# EAGLE design Plataforma_soldadora (EAGLE 6.5.0)
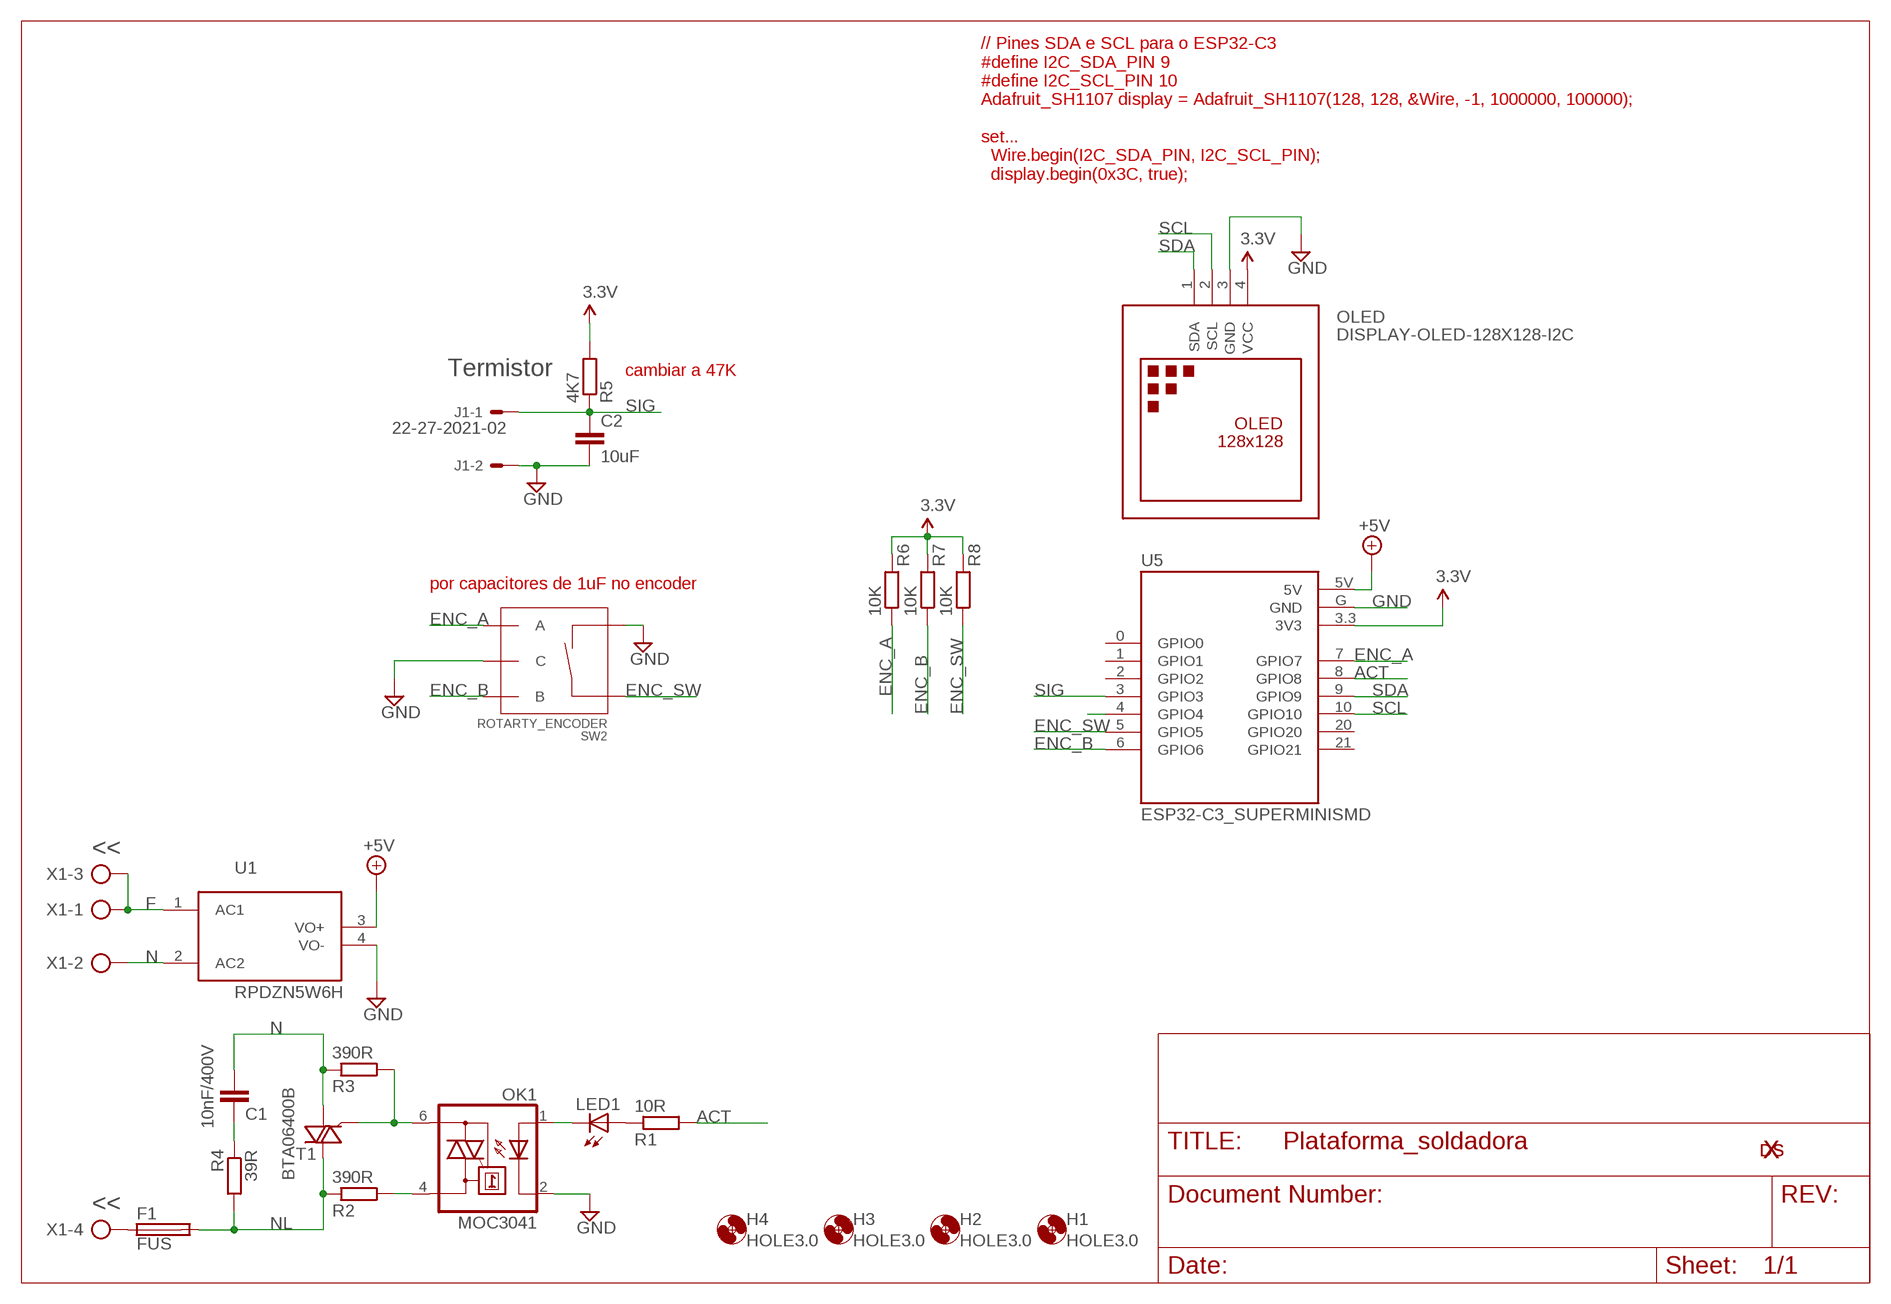
[diagram p0: schematic, sheet 1]

## Parts
C1  10nF/400V  C-EU075-042X103  [C075-042X103]
C2  10uF  C-EUC1206K  [C1206K]
F1  FUS  FUSETE5  [TE5]
H1  HOLE3.0  HOLES_MOUNT-HOLE3.0  [HOLES_3,0]
H2  HOLE3.0  HOLES_MOUNT-HOLE3.0  [HOLES_3,0]
H3  HOLE3.0  HOLES_MOUNT-HOLE3.0  [HOLES_3,0]
H4  HOLE3.0  HOLES_MOUNT-HOLE3.0  [HOLES_3,0]
J1  22-27-2021-02  [6410-02]
LED1  LED3MM  [LED3MM]
OK1  MOC3041  IL410  [DIL06]
OLED  DISPLAY-OLED-128X128-I2C  [DISPLAY-OLED-128X128-I2C]
R1  10R  R-EU_R0603  [R0603]
R2  390R  R-EU_0204/7  [0204/7]
R3  390R  R-EU_0204/7  [0204/7]
R4  39R  R-EU_0204/7  [0204/7]
R5  4K7  R-EU_R0603  [R0603]
R6  10K  R-EU_R0603  [R0603]
R7  10K  R-EU_R0603  [R0603]
R8  10K  R-EU_R0603  [R0603]
SW2  ROTARTY_ENCODER  [ROTARY_ENC_PLAIN]
T1  BTA06400B  BT136  [TO220AB]
U1  RPDZN5W6H  [RPDZN5W6H]
U5  ESP32-C3_SUPERMINISMD  [MODULE_ESP-C3_SUPERMINI_SMD]
U$2  XDESIG_XDESIG5MM  [XDESIG_XDESIG_CU]
U$3  XDESIG_XDESIG21  [XDESIG_XDESIG]
X1  AK500/4-H  [AK500/4-H]

## Nets
3.3V: OLED.4(VCC) R5.2 R6.2 R7.2 R8.2 U5.3.3(3V3)
+5V: U1.3(VO+) U5.5V
ACT: R1.2 U5.8(GPIO8)
ENC_A: R6.1 SW2.A U5.7(GPIO7)
ENC_B: R7.1 SW2.B U5.6(GPIO6)
ENC_SW: R8.1 SW2.SW+ U5.5(GPIO5)
F: U1.1(AC1) X1.1 X1.3
GND: C2.2 J1.2 OK1.2(C) OLED.3(GND) SW2.C SW2.SW- U1.4(VO-) U5.G(GND)
N: C1.2 R3.1 T1.1(A1) U1.2(AC2) X1.2
N$1: OK1.4(A1) R2.2
N$2: F1.1 X1.4
N$3: OK1.6(A2) R3.2 T1.3(G)
N$4: LED1.K(C) OK1.1(A)
N$5: LED1.A R1.1
N$11: C1.1 R4.1
N$120: U5.4(GPIO4)
NL: F1.2 R2.1 R4.2 T1.2(A2)
SCL: OLED.2(SCL) U5.10(GPIO10)
SDA: OLED.1(SDA) U5.9(GPIO9)
SIG: C2.1 J1.1 R5.1 U5.3(GPIO3)
Unconnected: U5.0(GPIO0) U5.1(GPIO1) U5.2(GPIO2) U5.20(GPIO20) U5.21(GPIO21)

## Notes on the sheet
- // Pines SDA e SCL para o ESP32-C3
  #define I2C_SDA_PIN 9
  #define I2C_SCL_PIN 10
  Adafruit_SH1107 display = Adafruit_SH1107(128, 128, &Wire, -1, 1000000, 100000);
  
  set...
    Wire.begin(I2C_SDA_PIN, I2C_SCL_PIN);
    display.begin(0x3C, true);
- Termistor | cambiar a 47K
- por capacitores de 1uF no encoder
- <<
- <<

## Library data of the parts
C1 C2 = rcl:C-EU: CAPACITOR, European symbol
F1 = fuse:FUSE: Fuse; OC_FARNELL: unknown; OC_NEWARK: unknown
H1-H4 = escorna_LBREscorna_CPU_2_10:HOLES_MOUNT-HOLE: MOUNTING HOLE with drill center marker
J1 = con-molex:22-?-02: CONNECTOR wire to board 2.54 mm (.1 inch) pitch header; OC_FARNELL: unknown; OC_NEWARK: unknown
LED1 = led:LED: LED OSRAM: - CHIPLED LG R971, LG N971, LY N971, LG Q971, LY Q971, LO R971, LY R971 LH N974, LH R974 LS Q976, LO Q976, LY Q976 LO Q996 - Hyper CHIPLED LW Q18S LB Q993, LB Q99A, LB R99A - SideLED LS A670, LO A670, LY A670, LG A670, LP A670 LB A673, LV A673, LT A673, LW A673 LH A674 LY A675 LS A676, LA A676, LO A676, LY A676, LW A676 LS A679, LY A679, LG A679 - Hyper Micro SIDELED® LS Y876, LA Y876, LO Y876, LY Y876 LT Y87S - SmartLED LW L88C, LW L88S LB L89C, LB L89S, LG L890 LS L89K, LO L89K, LY L89K LS L896, LA L896, LO L896, LY L896 - TOPLED LS T670, LO T670, LY T670, LG T670, LP T670 LSG T670, LSP T670, LSY T670, LOP T670, LYG T670 LG T671, LOG T671, LSG T671 LB T673, LV T673, LT T673, LW T673 LH T674 LS T676, LA T676, LO T676, LY T676, LB T676, LH T676, LSB T676, LW T676 LB T67C, LV T67C, LT T67C, LS T67K, LO T67K, LY T67K, LW E67C LS E67B, LA E67B, LO E67B, LY E67B, LB E67C, LV E67C, LT E67C LW T67C LS T679, LY T679, LG T679 LS T770, LO T770, LY T770, LG T770, LP T770 LB T773, LV T773, LT T773, LW T773 LH T774 LS E675, LA E675, LY E675, LS T675 LS T776, LA T776, LO T776, LY T776, LB T776 LHGB T686 LT T68C, LB T68C - Hyper Mini TOPLED® LB M676 - Mini TOPLED Santana® LG M470 LS M47K, LO M47K, LY M47K Source: http://www.osram.convergy.de LUXEON: - LUMILED® LXK2-PW12-R00, LXK2-PW12-S00, LXK2-PW14-U00, LXK2-PW14-V00 LXK2-PM12-R00, LXK2-PM12-S00, LXK2-PM14-U00 LXK2-PE12-Q00, LXK2-PE12-R00, LXK2-PE12-S00, LXK2-PE14-T00, LXK2-PE14-U00 LXK2-PB12-K00, LXK2-PB12-L00, LXK2-PB12-M00, LXK2-PB14-N00, LXK2-PB14-P00, LXK2-PB14-Q00 LXK2-PR12-L00, LXK2-PR12-M00, LXK2-PR14-Q00, LXK2-PR14-R00 LXK2-PD12-Q00, LXK2-PD12-R00, LXK2-PD12-S00 LXK2-PH12-R00, LXK2-PH12-S00 LXK2-PL12-P00, LXK2-PL12-Q00, LXK2-PL12-R00 Source: www.luxeon.com KINGBRIGHT: KA-3528ASYC Source: www.kingbright.com
OK1 = optocoupler:IL410: SIEMENS OPTO COUPLER; MF: VISHAY/TELEFUNKEN; MPN: IL410; OC_FARNELL: 1045434; OC_NEWARK: 58K1715
OLED = diy-modules:DISPLAY-OLED-128X128-I2C
R1-R8 = rcl:R-EU_: RESISTOR, European symbol
SW2 = SparkFun-Electromechanical:ROTARTY_ENCODER: Simple no LED rotary encoder Example: COM-09117
T1 = triac:BT136: Triac BT136 series E sensitive gate Source: http://www.nxp.com/acrobat_download/datasheets/BT136_SERIES_E_2.pdf
U1 = RPDZN:RPDZN5W6
U5 = ESP32-C3_SUPERMINI:ESP32-C3_SUPERMINI: Check availability <https://pricing.snapeda.com/parts/ESP32-C3%20SuperMini/Espressif%20Systems/view-part?ref=eda>
U$2 U$3 = Echidna_shield_LBR:XDESIG_XDESIG
X1 = con-ptr500:AK500/4-H: CONNECTOR Aug. 2004 / PTR Meßtechnik: Die Bezeichnung der Serie AK505 wurde geändert. Es handelt sich hierbei um AK500 in horizontaler Ausführung.; OC_FARNELL: unknown; OC_NEWARK: unknown

## Board
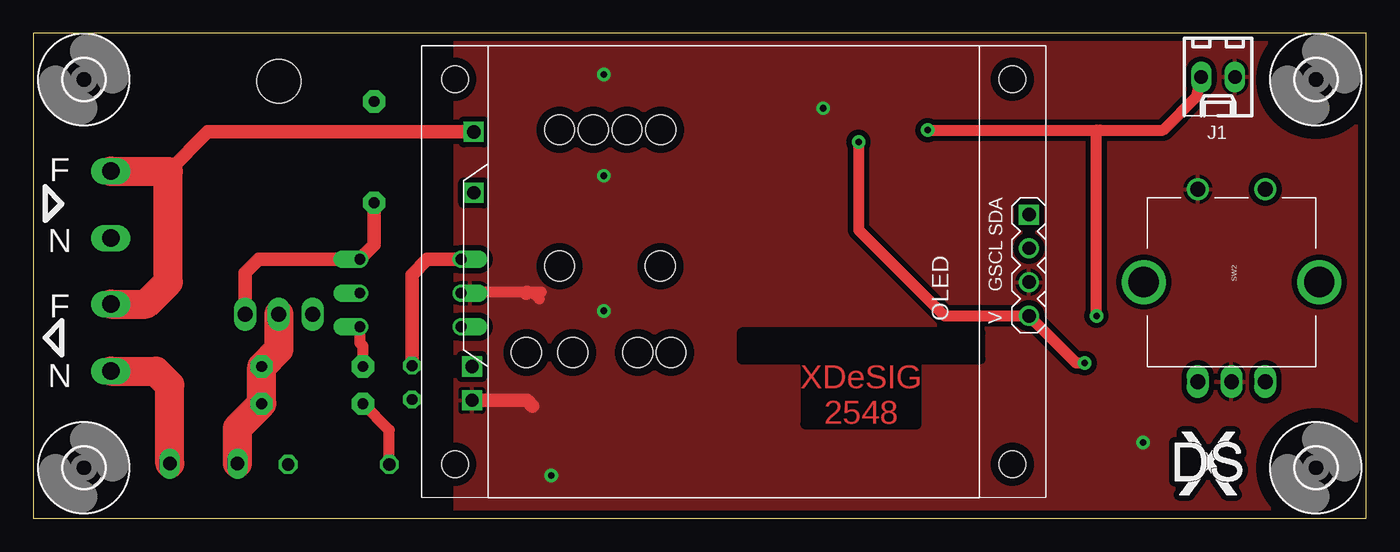
[diagram p1: board, top side]
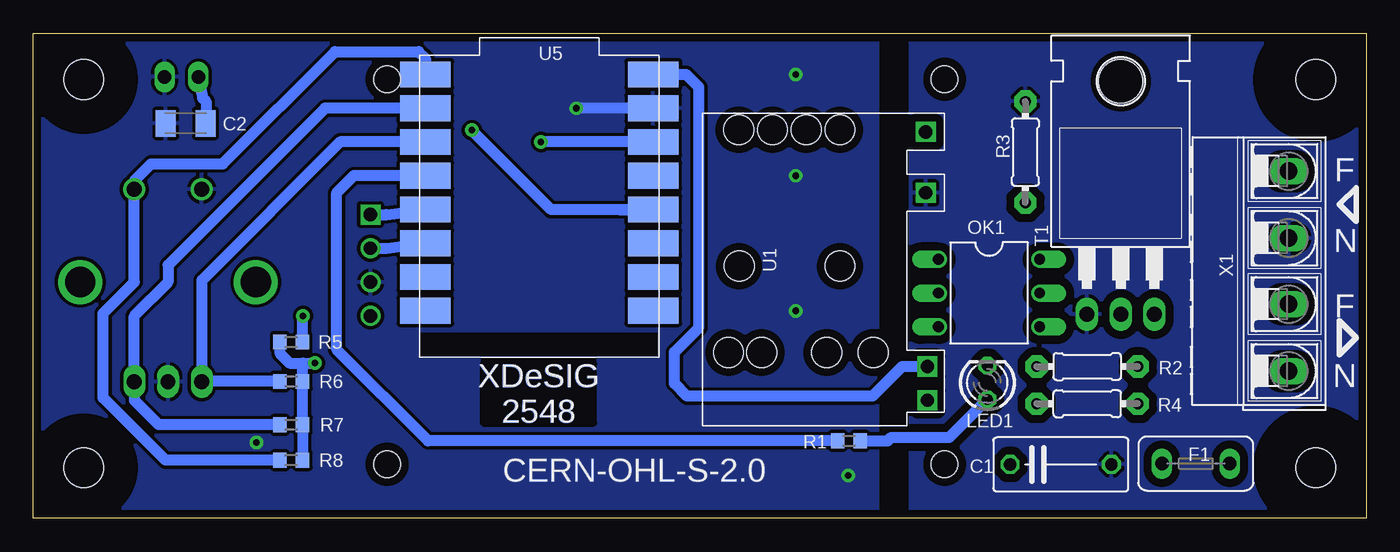
[diagram p2: board, bottom side, seen from below]

Size 100.31 x 36.5 mm. Coordinates in mm from the lower left corner, seen from the top.
Outline: 0,0 100.31,0 100.31,36.5 0,36.5 0,0
Copper layers (1*16): Top 0.035mm / dielectric 1.5mm / Bottom 0.035mm
Design rules "Vias_pintadas": minimum track width 10mil, minimum drill 22mil, track to track 10mil, track to pad 10mil, pad to pad 8mil, via to via 12mil, smd to smd 8mil, copper to edge 24mil, drill to drill 12mil, minimum pad ring 10mil, minimum via ring 10mil, stop-mask expansion 2mil, vias tented up to drill 30mil, thermal gap 10mil
tRestrict: area 53.3,12 to 71.2,14
bRestrict: area 55.9,12.4 to 56.8,14; area 53.3,12.1 to 71.2,14

### Footprints (pad centres in the part's own frame; a part is rotated, then mirrored left to right if it is on the bottom)
C075-042X103 = drill 0.914 octagon: 1 -3.81,0; 2 3.81,0
C1206K = smd 1.5 x 2: 1 -1.5,0; 2 1.5,0
TE5 = drill 1.016 long: 1 -2.54,0; 2 2.54,0
HOLES_3,0 = hole 3: 0,0
6410-02 = drill 1.016 long: 1 1.27,0; 2 -1.27,0
LED3MM = drill 0.813 octagon: A -1.27,0; K 1.27,0
DIL06 = drill 0.813 offset: 1 -2.54,-3.81; 2 0,-3.81; 3 2.54,-3.81; 4 2.54,3.81; 5 0,3.81; 6 -2.54,3.81
DISPLAY-OLED-128X128-I2C = drill 1 square: 1 12.7,45.72 | drill 1: 2 15.24,45.72; 3 17.78,45.72; 4 20.32,45.72 | hole 2: 2.52,44.48; 31.48,44.48; 31.48,2.52; 2.52,2.52
R0603 = smd 1 x 1.1: 1 -0.85,0; 2 0.85,0
0204/7 = drill 0.813 pad 1.676 octagon: 1 -3.81,0; 2 3.81,0
ROTARY_ENC_PLAIN = drill 1.1 long: A 7.493,-2.54; B 7.493,2.54; C 7.493,0 | drill 2.286: P$3 0,6.604; P$4 0,-6.604 | drill 1.1: SW+ -6.985,2.54; SW- -6.985,-2.54
TO220AB = drill 1.118 long: 1 -2.54,-6.35; 2 0,-6.35; 3 2.54,-6.35 | hole 3.302: 0,11.176
RPDZN5W6H = drill 1 square: 1 22.095,1.4; 2 17.513,1.4; 3 4.445,1.27; 4 1.905,1.27 | hole 2.25: 5.5,8.85; 5.5,5.36; 5.5,13.75; 5.5,16.25; 12,7.85; 12,15.44; 22.26,7.85; 22.26,10.39; 22.26,12.93; 22.26,15.47
MODULE_ESP-C3_SUPERMINI_SMD = smd 3.81 x 1.93: 0 8.572,-9.144; 1 8.572,-6.604; 2 8.572,-4.064; 3 8.572,-1.524; 3.3 8.572,3.556; 4 8.572,1.016; 5 -8.572,8.636; 5V 8.572,8.636; 6 -8.572,6.096; 7 -8.572,3.556; 8 -8.572,1.016; 9 -8.572,-1.524; 10 -8.572,-4.064; 20 -8.572,-6.604; 21 -8.572,-9.144; G 8.572,6.096
AK500/4-H = drill 1.321 long: 1 -7.518,0; 2 -2.489,0; 3 2.489,0; 4 7.518,0

### Placement (x,y rotation side)
C1  22.99,4.06 0 bottom
C2  88.84,29.72 180 bottom
F1  12.83,4.13 180 bottom
H1  3.81,3.81 0 top
H2  3.81,33.02 0 top
H3  96.52,33.02 0 top
H4  96.52,3.81 0 top
J1  89.15,33.21 180 top
LED1  28.51,10.22 90 bottom
OK1  28.38,16.95 270 bottom
OLED  29.21,35.56 270 top
R1  38.93,5.84 180 bottom
R2  21,11.43 180 bottom
R3  25.65,27.56 270 bottom
R4  21,8.64 0 bottom
R5  47K  [R0603]  80.9,13.27 180 bottom
R6  80.89,10.31 0 bottom
R7  80.9,7.05 0 bottom
R8  80.9,4.38 0 bottom
SW2  90.17,17.78 270 top
T1  18.48,21.72 0 bottom
U1  31.75,6.99 90 bottom
U5  62.23,24.77 0 bottom
U$2  85.92,1.78 0 top
U$3  85.92,1.78 0 top
X1  5.84,18.61 270 bottom

### Tracks (layer width: path | path; a pad name or v marks a point on that pad's centre or on a via)
3.3V  (via drill 0.5)
  Top 0.813: v62.1,28.32 62.1,21.72 68.58,15.24 OLED.4 78.49,11.68 v79.12,11.68
  Bottom 0.813: R8.2 R7.2 R6.2 80.04,11.65 80.01,11.68 | 53.59,28.32 U5.3.3 v62.1,28.32 | R5.2 81.72,13.25 81.72,12.38 81.03,11.68 80.01,11.68 | 80.01,11.68 v79.12,11.68
+5V
  Bottom 0.813: U1.3 34.92,11.43 37.15,9.21 51.12,9.21 52.07,10.16 52.07,12.51 50.23,14.35 50.23,32.45 51.18,33.4 U5.5V 53.72,33.4
ACT
  Bottom 0.813: U5.8 76.2,25.78 77.47,24.51 77.47,12.7 70.61,5.84 R1.2
ENC_A
  Bottom 0.813: U5.7 77.22,28.32 87.61,17.93 87.61,10.31 | R6.1 87.61,10.31 | 87.61,10.31 SW2.A
ENC_B
  Bottom 0.813: R7.1 90.87,7.05 92.71,8.89 SW2.B 92.71,15.24 90.17,17.78 90.17,19.05 78.36,30.86 U5.6
ENC_SW
  Bottom 0.813: R8.1 90.36,4.38 95.06,9.08 95.06,15.43 92.71,17.78 SW2.SW+ 92.71,25.4 91.44,26.67 86.04,26.67 77.6,35.12 71.31,35.12 70.8,34.61 U5.5
F
  Top 1.016: U1.1 13.14,29.08 10.16,26.1
  Top 2.184: X1.3 8.5,16.12 10.16,17.78 10.16,26.1 5.87,26.1 X1.1
GND  (via drill 0.5)
  Top 0.813: 37.15,17.02 37.59,17.02 38.1,16.51 | 37.08,16.95 38.23,17.02 32.26,17.02 OK1.2
  Top 1.016: 37.08,16.95 37.15,17.02 | U1.4 37.15,8.89 37.59,8.45
  Bottom 0.813: U5.G v59.44,30.86
  other vias: 42.93,15.62 42.93,25.78 38.99,3.24 42.93,33.4 83.5,5.71
  pour Bottom: 100.33,36.83 36.83,36.83 36.83,0 100.33,0
  pour Top (isolate 0.406): 100.33,36.83 31.75,36.83 31.75,0 100.33,0
N
  pour Bottom (isolate 0.61): 0,0 0,36.83 34.29,36.83 34.29,0
N$1
  Top 0.813: OK1.4 24.57,13.21 24.81,12.97 R2.2
N$2
  Top 2.184: X1.4 9.23,11.09 10.29,10.03 F1.1
N$3
  Top 1.016: R3.2 25.65,20.57 OK1.6 16.95,19.49 15.94,18.48 T1.3
N$4
  Top 1.016: LED1.K 28.51,18.35 29.65,19.49 OK1.1
N$5
  Bottom 0.813: R1.1 36.01,5.84 35.75,6.1 31.37,6.1 LED1.A
N$11
  Top 0.813: C1.1 26.8,6.65 R4.1
NL
  Top 2.184: F1.2 15.37,6.81 R4.2 R2.1 18.48,12.72 T1.2
SCL
  Bottom 0.813: OLED.2 73.72,20.32 U5.10
SDA
  Bottom 0.813: OLED.1 73.72,22.86 U5.9
SIG  (via drill 0.5)
  Top 0.813: v67.31,29.21 80.01,29.21 | 80.01,29.21 80.26,29.21 | 80.26,29.21 85.03,29.21 87.57,31.75 J1.1 | 80.14,29.08 80.26,29.21 | v80.01,15.24 80.01,29.21
  Bottom 0.813: J1.1 87.57,31.62 87.31,31.37 87.31,29.74 C2.1 | 56.17,23.22 U5.3 61.34,23.24 v67.31,29.21 | R5.1 80.05,15.2 v80.01,15.24

### Text on the board
Top: XDeSIG / 2548
Bottom: XDeSIG / 2548
tPlace: F | N | F | N
bPlace: F | N | F | N | XDeSIG / 2548 | CERN-OHL-S-2.0